# Altium schematic sheet Power Supply.SchDoc
size A4
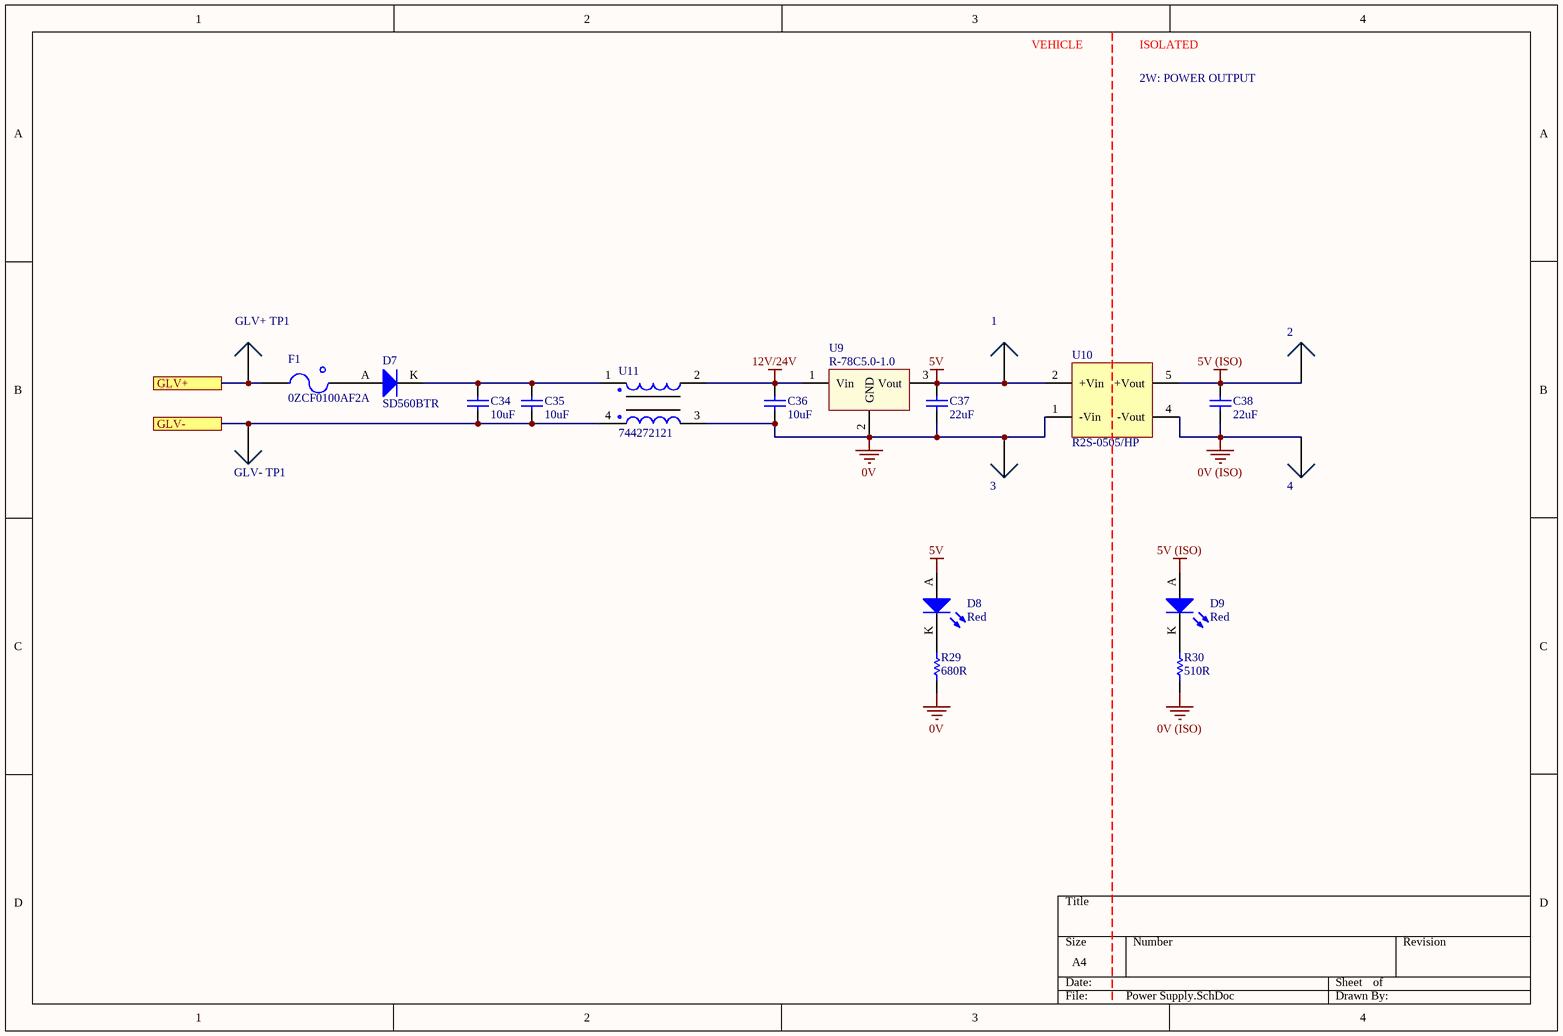
[diagram p0: Power Supply.SchDoc]

## Parts
1  0mm  [SMD Test Point]  (value not drawn)
2  0mm  [SMD Test Point]  (value not drawn)
3  0mm  [SMD Test Point]  (value not drawn)
4  0mm  [SMD Test Point]  (value not drawn)
C34  10uF  [0805]
C35  10uF  [0805]
C36  10uF  [0805]
C37  22uF  [1206]
C38  22uF  [1206]
D7  SD560BTR  [SMB Diode]
D8  Red  [0805 LED]
D9  Red  [0805 LED]
F1  0ZCF0100AF2A  [2920]
GLV+_TP1  0mm  [SMD Test Point]  (value not drawn)
GLV-_TP1  0mm  [SMD Test Point]  (value not drawn)
R29  680R  [0805]
R30  510R  [0805]
U9  R-78C5.0-1.0  [RECOM 3-SIP]
U10  R2S-0505/HP  [RECOM 8-SMD (5 Pin)]
U11  744272121  [Wurth 4-PC Pad]

## Ports
GLV+, GLV-

## Nets
0V: 3.1 C36.1 C37.1 R29.1 U9.2(GND) U10.1(-Vin) U11.3
0V (ISO): 4.1 C38.1 R30.1 U10.4(-Vout)
5V: 1.1 C37.2 D8.A U9.3(Vout) U10.2(+Vin)
5V (ISO): 2.1 C38.2 D9.A U10.5(+Vout)
12V/24V: C36.2 U9.1(Vin) U11.2
GLV+: F1.1 GLV+_TP1.1 ; port GLV+
GLV-: C34.1 C35.1 GLV-_TP1.1 U11.4 ; port GLV-
NetC34_2: C34.2 C35.2 D7.K U11.1
NetD7_A: D7.A F1.2
NetD8_K: D8.K R29.2
NetD9_K: D9.K R30.2

## Notes on the sheet
- VEHICLE
- ISOLATED
- 2W: POWER OUTPUT

## Library data of the parts
1-4 GLV+_TP1 GLV-_TP1 = SMD Test Point: Positions: 1; Row Spacing: 0; Flange: No; Contact: NA; Part Number: SMD Test Point; Pitch: 0mm; Angle: 0
C34-C36 = GRM21BR6YA106KE43L: Manufacturer: muRata; Tolerance: 10%; Material: X5R; Rated Voltage: 50V; Part Number: GRM21BR6YA106KE43L; Value: 10uF; Digikey Part Number: 490-10514-6-ND
C37 C38 = CC1206MKX5R7BB226: Manufacturer: YAGEO; Tolerance: 20%; Material: Ceramic; Rated Voltage: 16V; Part Number: CC1206MKX5R7BB226; Value: 22uF; Digikey Part Number: 311-1997-2-ND
D7 = SD560BTR: 1.2V_F 600V 5A SMB; Manufacturer: SMC Diode Solutions; Part Number: SD560BTR; Digikey Part Number: 1655-1530-2-ND; Digikey Link: https://www.digikey.com/product-detail/en/smc-diode-solutions/SD560BTR/1655-1530-2-ND/6022620
D8 D9 = SML-210LTT86: Red LED Indication - Discrete 1.75V 0805 (2012 Metric); Manufacturer: ROHM Semiconductor; Part Number: SML-210LTT86; Colour: Red; Digikey Part Number: 511-1286-1-ND; Digikey Link: https://www.digikey.com/product-detail/en/rohm-semiconductor/SML-210LTT86/511-1286-1-ND/637099
F1 = 0ZCF0100AF2A: PTC RESET FUSE 60V 1A 292; Manufacturer: Littelfuse Inc.; Part Number: 0ZCF0100AF2A; Digikey Part Number: 507-2070-1-ND; Digikey Link: https://www.digikey.com/product-detail/en/bel-fuse-inc/0ZCF0100AF2A/507-2070-1-ND/6210547
R29 = RC0805FR07680RL: Manufacturer: YAGEO; Tolerance: 0.01; Rated Voltage: 0.125W; Part Number: RC0805FR07680RL; Value: 680R; Material: FR-07
R30 = RC0805FR07510RL: Manufacturer: YAGEO; Tolerance: 0.01; Rated Voltage: 0.125W; Part Number: RC0805FR07510RL; Value: 510R; Material: FR-07
U9 = R-78C5.0-1.0: CONV DC/DC 1A 5V OUT SIP VERT; Manufacturer: Recom; Isolation: Non-Isolated; Part Number: R-78C5.0-1.0; Digikey Part Number: 945-1395-5-ND; Digikey Link: https://www.digikey.com.au/product-detail/en/recom-power/R-78C5.0-1.0/945-1395-5-ND/2652148
U10 = R2S-0505/HP: Isolated Module DC DC Converter 1 Output 3.3V 606mA 4.5V - 5.5V Input; Manufacturer: Recom; Output Voltage: 5V; Output Power: 2W; Efficiency: 0.85; Part Number: R2S-0505/HP; Input Voltage: 4.5V-5.5V; Isolation: Isolated; Digikey Part Number: 945-1764-5-ND; Digikey Link: https://www.digikey.com/product-detail/en/recom-power/R2S-0505-HP/945-1764-5-ND/2302761
U11 = 744272121: 120µH @ 100kHz 2 Line Common Mode Choke Surface Mount 460 Ohms @ 30MHz 2.5A DCR 25mOhm; Manufacturer: Wurth Electronics Inc; Inductance: 120uH @ 100kHz; Part Number: 744272121; Impedence: 460 Ohms @ 30MHz; Material: Wirewound; Rated Current: 2.5A; Digikey Part Number: 732-1489-1-ND; Digikey Link: https://www.digikey.com/product-detail/en/w-rth-elektronik/744272121/732-1489-1-ND/1639501